# Altium schematic sheet VOLTAGE_REFERENCE.SchDoc
size A4
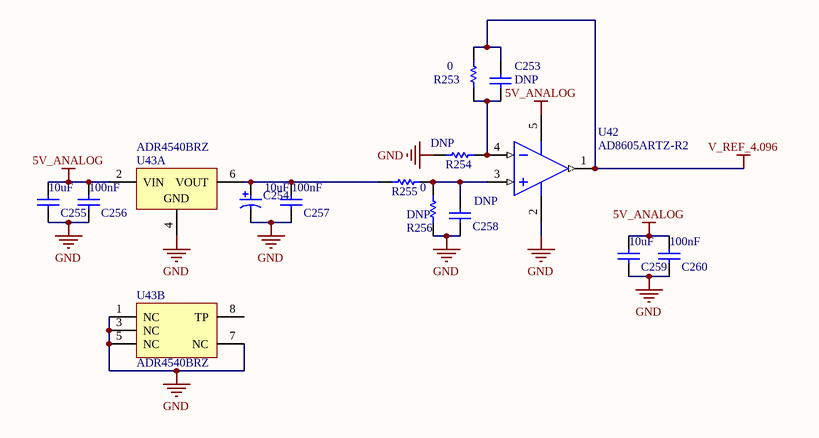
[diagram p0: VOLTAGE_REFERENCE.SchDoc]

## Parts
C253  value DNP  [CAPC0402(1005)60_L]  (hidden comment: CAP0402)
C254  Capacitance: 10uF  [KEMT-A-3216-18-2_M]  (hidden comment: T491A106K016AT)
C255  value 10uF  [CAPC0805(2012)145_L]  (hidden comment: CAP0805)
C256  value 100nF  [CAPC0402(1005)60_L]  (hidden comment: CAP0402)
C257  value 100nF  [CAPC0402(1005)60_L]  (hidden comment: CAP0402)
C258  value DNP  [CAPC0402(1005)60_L]  (hidden comment: CAP0402)
C259  value 10uF  [CAPC0805(2012)145_L]  (hidden comment: CAP0805)
C260  value 100nF  [CAPC0402(1005)60_L]  (hidden comment: CAP0402)
R253  value 0  [RESC0402(1005)_L]  (hidden comment: RES0402)
R254  value DNP  [RESC0402(1005)_L]  (hidden comment: RES0402)
R255  value 0  [RESC0402(1005)_L]  (hidden comment: RES0402)
R256  value DNP  [RESC0402(1005)_L]  (hidden comment: RES0402)
U42  AD8605ARTZ-R2  [ADI-RJ-5_L]
U43  ADR4540BRZ  [ADI-R-8_M]  (parts A,B of 2)

## Nets
5V_ANALOG: C255.2 C256.1 C259.2 C260.1 U42.5(+V) U43.2(VIN)
GND: C254.2 C255.1 C256.2 C257.2 C258.2 C259.1 C260.2 R254.1 R256.2 U42.2(-V) U43.1(NC) U43.3(NC) U43.4(GND) U43.5(NC) U43.7(NC)
V_REF_4.096: C253.1 R253.1 U42.1(OUT)
NetC253_2: C253.2 R253.2 R254.2 U42.4(-IN)
NetC254_1: C254.1 C257.1 R255.1 U43.6(VOUT)
NetC258_1: C258.1 R255.2 R256.1 U42.3(+IN)

Not connected (* = marked no-connect by the designer): U43 8(TP)

## Library data of the parts
C253 C256-C258 C260 = CMP-1590-00004-1: 0402 (1005 Metric) Chip Capacitor; Case-EIA: 0402; Case-Metric: 1005; PackageReference: CAPC0402(1005)60
C254 = CMP-2000-05173-1: Capacitor, Tantalum, 10 uF, +/- 10%, 16 V, -55 to 125 degC, 2-Pin SMD (1206), RoHS, Tape and Reel; Manufacturer: Kemet; Insulation: NotRequired; Voltage: 16VDC; Product Height (mm): 1.6mm; Polarity: Polar; Lead Spacing (nom): NotRequiredmm; Product Length (mm): 3.2mm; Case Style: Molded; DCL: 1.6uA; ESR: 7ohm; DF: 8%; Mounting Style: SurfaceMount; Manufacturer URL: http://www.kemet.com/; Datasheet Version: Apr-14; Package Description: 2-Pin Surface Mount Device, Body 3.2 x 1.6 mm; Operating Temp Range: -55Cto125C; Package Reference: 1206; Wire Form: NotRequired; Datasheet URL: http://www.farnell.com/datasheets/1824869.pdf; Tolerance (+ or -): 10%; Failure Rate: NotRequired; Length W/Weld: NotRequiredmm; Package / Case: 3216-18; Seated Plane Height: NotRequiredmm; Product Diameter (mm): NotRequiredmm; Construction: SMTChip; Seal: NotRequired; Case Code: A; Product Depth (mm): 1.6mm; Packaging: TapeandReel
C255 C259 = CMP-1590-00003-1: 0805 (2012 Metric) Chip Capacitor; Case-EIA: 0805; Case-Metric: 2012; PackageReference: CAPC0805(2012)145
R253-R256 = CMP-1591-00004-1: 0402 (1005 Metric) Chip Resistor; Case-EIA: 0402; Case-Metric: 1005; PackageReference: RESC0402(1005)
U42 = CMP-0384-01518-1: Single Channel Wide Bandwidth Operational Amplifier, 10 MHz BW, 5 V/us SR, Industrial, 5-pin SOT23 (RJ-5), Reel; Generic Part Number: AD8605; Manufacturer: Analog Devices; Input Offset Voltage: 20uV; Small Signal Bandwidth: 10MHz; Slew Rate: 5V/us; V Span Min: 2.7V; Amplifiers Per Package: 1; Input Bias Current: 200fA; V Span Max: 6V; Iq/Amp: 1.2mA; ComponentLink2URL: http://www.analog.com/static/imported-files/data_sheets/AD8605_8606_8608.pdf; Code_JEDEC: MO-178-AA; ComponentLink1URL: http://www.analog.com/en/index.html; ComponentLink1Description: Manufacturer URL; Mounting Technology: Surface Mount; PackageReference: RJ-5; ComponentLink3Description: Package Specification; ComponentLink3URL: http://www.analog.com/static/imported-files/packages/PKG_PDF/SOT-23(RJ)/RJ_5.pdf; PackageDescription: 5-Pin Small Outline Transistor Package, Body 2.9 x 1.6 mm, Pitch 0.95 mm; PackageVersion: 121608-A; PartNumber: AD8605ARTZ-R2; ComponentLink2Description: Datasheet; ComponentLink4Description: URL Link1; ComponentLink4URL: Reference Circuit:http://www.analog.com/en/all-operational-amplifiers-op-amps/operational-amplifiers-op-amps/ad8605/products/product.html#product-recommendations; DatasheetVersion: Rev. L
U43 = CMP-0784-00192-1: Ultralow Noise, High Accuracy Voltage Reference, 4.096 V Output, 3 to 15 V Supply, Industrial, 8-pin SOIC (R-8), Tube; Manufacturer: Analog Devices; Max V Supply (V): 15; Min V Supply (V): 3; Vout: 4.096V; Ref Out TC (ppm/C): 2; ComponentLink4URL: Product URL:http://www.analog.com/en/special-linear-functions/voltage-references/adr4540/products/product.html; Mounting Technology: Surface Mount; ComponentLink1Description: Manufacturer URL; PackageDescription: 8-Pin Standard Small Outline Package, Body 4.9 x 3.9 mm, Pitch 1.27 mm; ComponentLink2URL: http://www.analog.com/static/imported-files/data_sheets/ADR4520_4525_4530_4533_4540_4550.pdf; ComponentLink1URL: http://www.analog.com/en/index.html; DatasheetVersion: Rev. 0; ComponentLink4Description: URL Link1; Operating Temp Range: -40 to 125 degC; PartNumber: ADR4540BRZ; ComponentLink2Description: Datasheet; ComponentLink3URL: http://www.analog.com/static/imported-files/packages/PKG_PDF/SOIC_Narrow%20(R)/R_8.pdf; ComponentLink3Description: Package Specification; PackageVersion: 060506-A, 06/2006; Packing: Tube; PackageReference: R-8; Code_JEDEC: MS-012-AA